# EAGLE schematic Communication Connections (EAGLE 8.5.2)
REV: 1
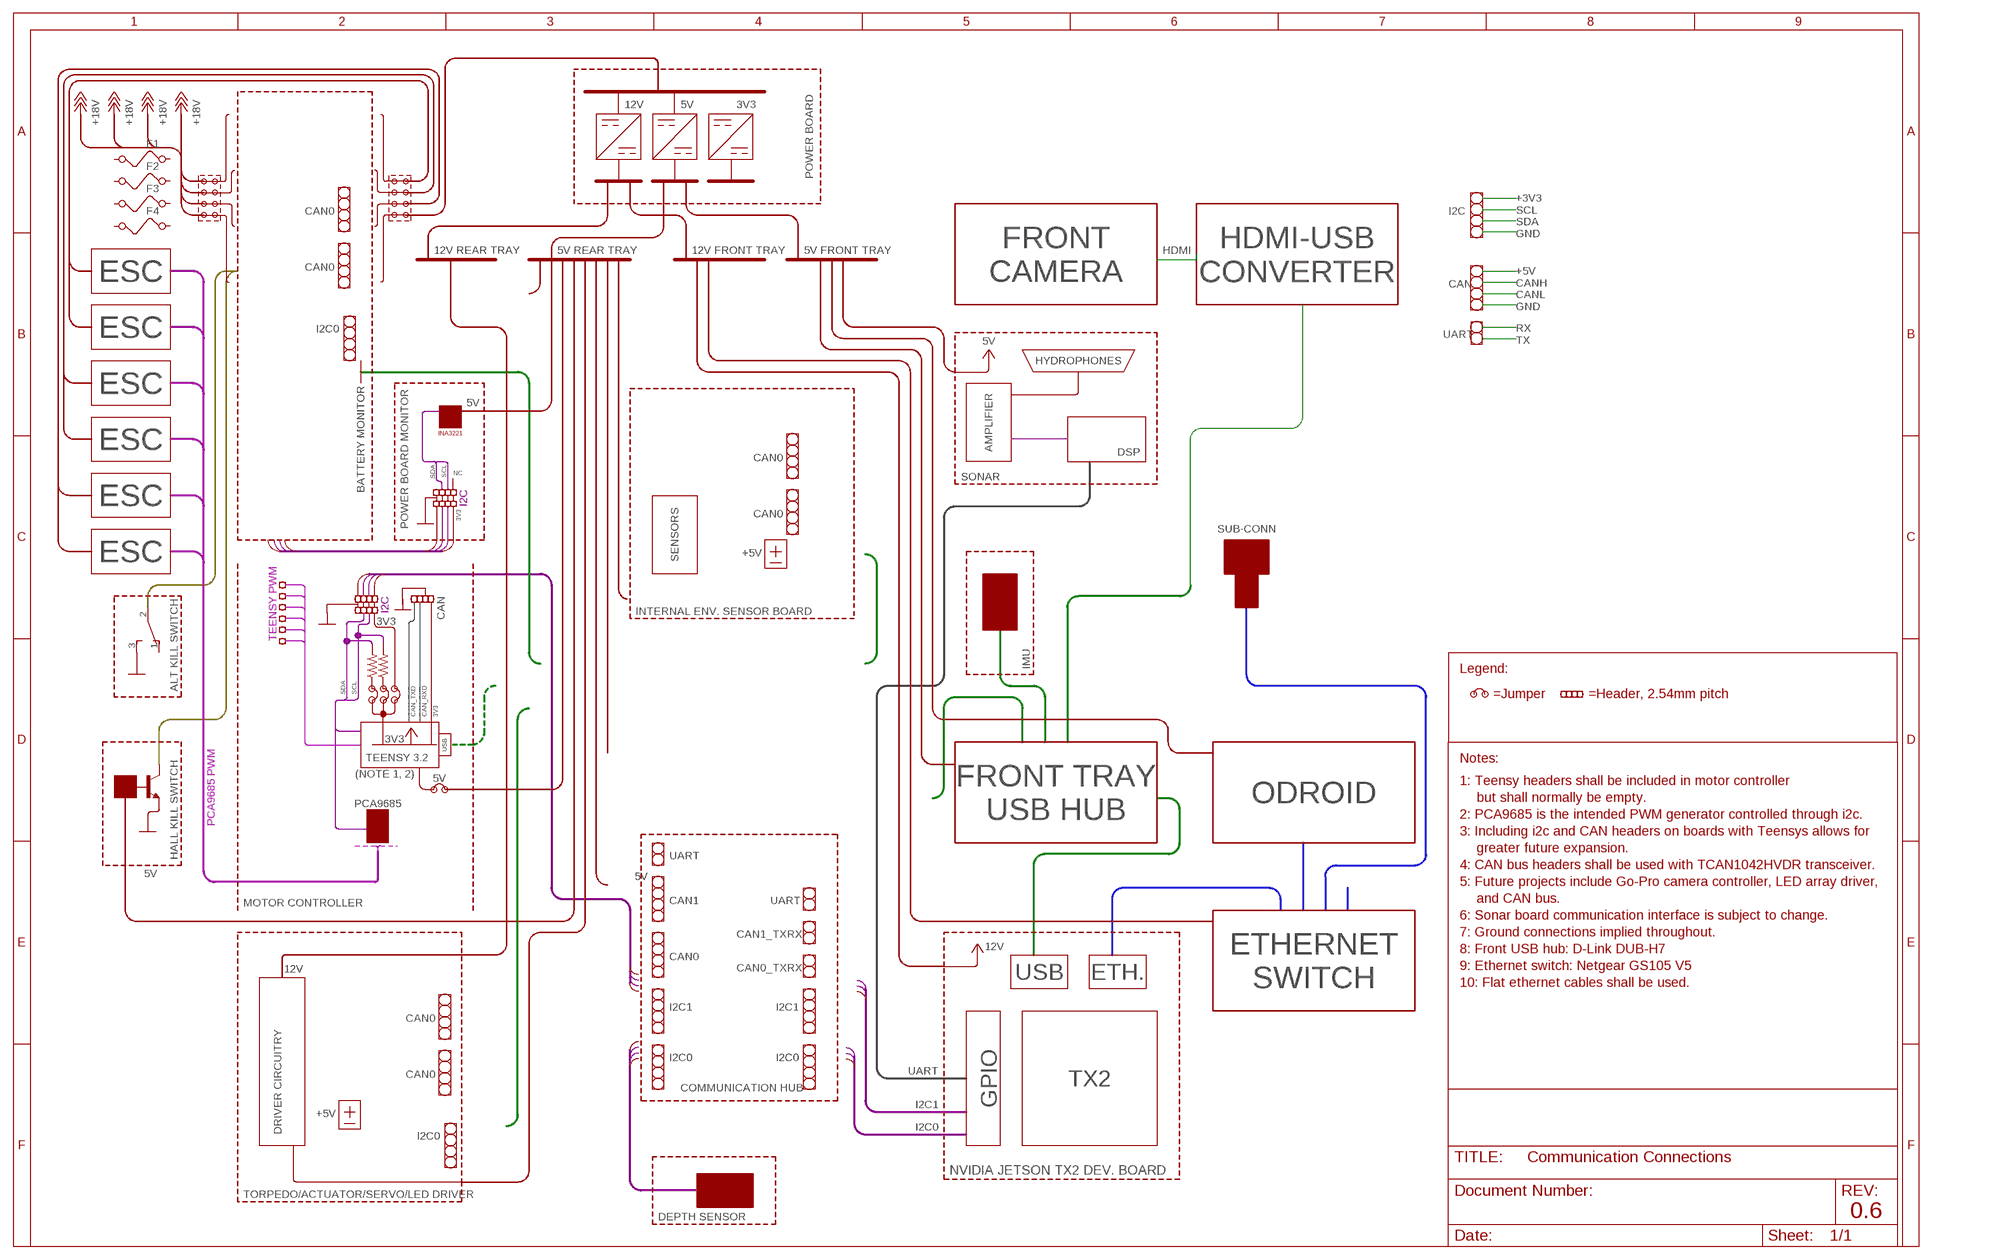
[diagram p0: schematic, sheet 1]

## Parts
F1  FUSE  [FUSE]
F2  FUSE  [FUSE]
F3  FUSE  [FUSE]
F4  FUSE  [FUSE]
Q4  BC849SMD  [SOT23-BEC]
R7  R-US_0613/15  [P0613/15]
R8  R-US_0613/15  [P0613/15]
S1  TL36WO  [TL3XWO]
Unconnected: F1.1 F1.2 F2.1 F2.2 F3.1 F3.2 F4.1 F4.2 Q4.B Q4.C Q4.E R7.1 R7.2 R8.1 R8.2 S1.1(O) S1.2(P) S1.3(S)

## Notes on the sheet
- 12V | 5V | 3V3
- POWER BOARD
- CAN0 | I2C
- FRONT
- +3V3
  SCL
  SDA
  GND
- 12V REAR TRAY | 5V REAR TRAY | 12V FRONT TRAY | 5V FRONT TRAY | HDMI
- HDMI-USB
  CONVERTER
- ESC | CAN0 | CAMERA
- CAN
- +5V
  CANH
  CANL
  GND
- ESC
- I2C0
- 5V | UART
- RX
  TX
- HYDROPHONES
- ESC
- 5V
- AMPLIFIER
- INA3221
- ESC | BATTERY MONITOR
- DSP
- CAN0
- SDA | SCL
- SONAR
- NC
- ESC
- I2C
- 3V3
- CAN0
- POWER BOARD MONITOR | SUB-CONN
- SENSORS
- ESC
- +5V
- I2C | CAN
- INTERNAL ENV. SENSOR BOARD
- 3V3
- TEENSY PWM
- Legend:
- IMU
- ALT KILL SWITCH | =Jumper | =Header, 2.54mm pitch
- SDA | SCL
- CAN_TXD | CAN_RXD | 3V3
- 3V3
- USB
- Notes:
- TEENSY 3.2
- (NOTE 1, 2)
- 5V | FRONT TRAY | 1: Teensy headers shall be included in motor controller
- ODROID | but shall normally be empty.
- PCA9685
- USB HUB | 2: PCA9685 is the intended PWM generator controlled through i2c.
- PCA9685 PWM | 3: Including i2c and CAN headers on boards with Teensys allows for
- greater future expansion.
- HALL KILL SWITCH | UART | 4: CAN bus headers shall be used with TCAN1042HVDR transceiver.
- 5V | 5V | 5: Future projects include Go-Pro camera controller, LED array driver,
- and CAN bus.
- MOTOR CONTROLLER
- CAN1 | UART
- 6: Sonar board communication interface is subject to change.
- 7: Ground connections implied throughout.
- CAN1_TXRX
- 12V | ETHERNET | 8: Front USB hub: D-Link DUB-H7
- CAN0 | 9: Ethernet switch: Netgear GS105 V5
- 12V | CAN0_TXRX | USB | ETH.
- SWITCH | 10: Flat ethernet cables shall be used.
- I2C1 | I2C1
- CAN0
- I2C0 | I2C0
- UART
- CAN0 | GPIO | TX2
- COMMUNICATION HUB
- I2C1
- +5V
- I2C0
- DRIVER CIRCUITRY
- I2C0
- NVIDIA JETSON TX2 DEV. BOARD
- TORPEDO/ACTUATOR/SERVO/LED DRIVER
- DEPTH SENSOR | 0.6

## Library data of the parts
F1-F4 = special:FUSE: FUSE 5 x 20 mm
Q4 = transistor-npn:BC849*: NPN Transistor
R7 R8 = rcl:R-US_: RESISTOR, American symbol
S1 = switch:TL36WO: TINY SWITCH ON - ON Source: http://www2.produktinfo.conrad.com/datenblaetter/700000-724999/705152-da-01-de-Subminiaturschalter_TL_36WO.pdf